# Altium schematic sheet DSP_Block.SchDoc
size A3; SheetNumber: 4; SheetTotal: 8
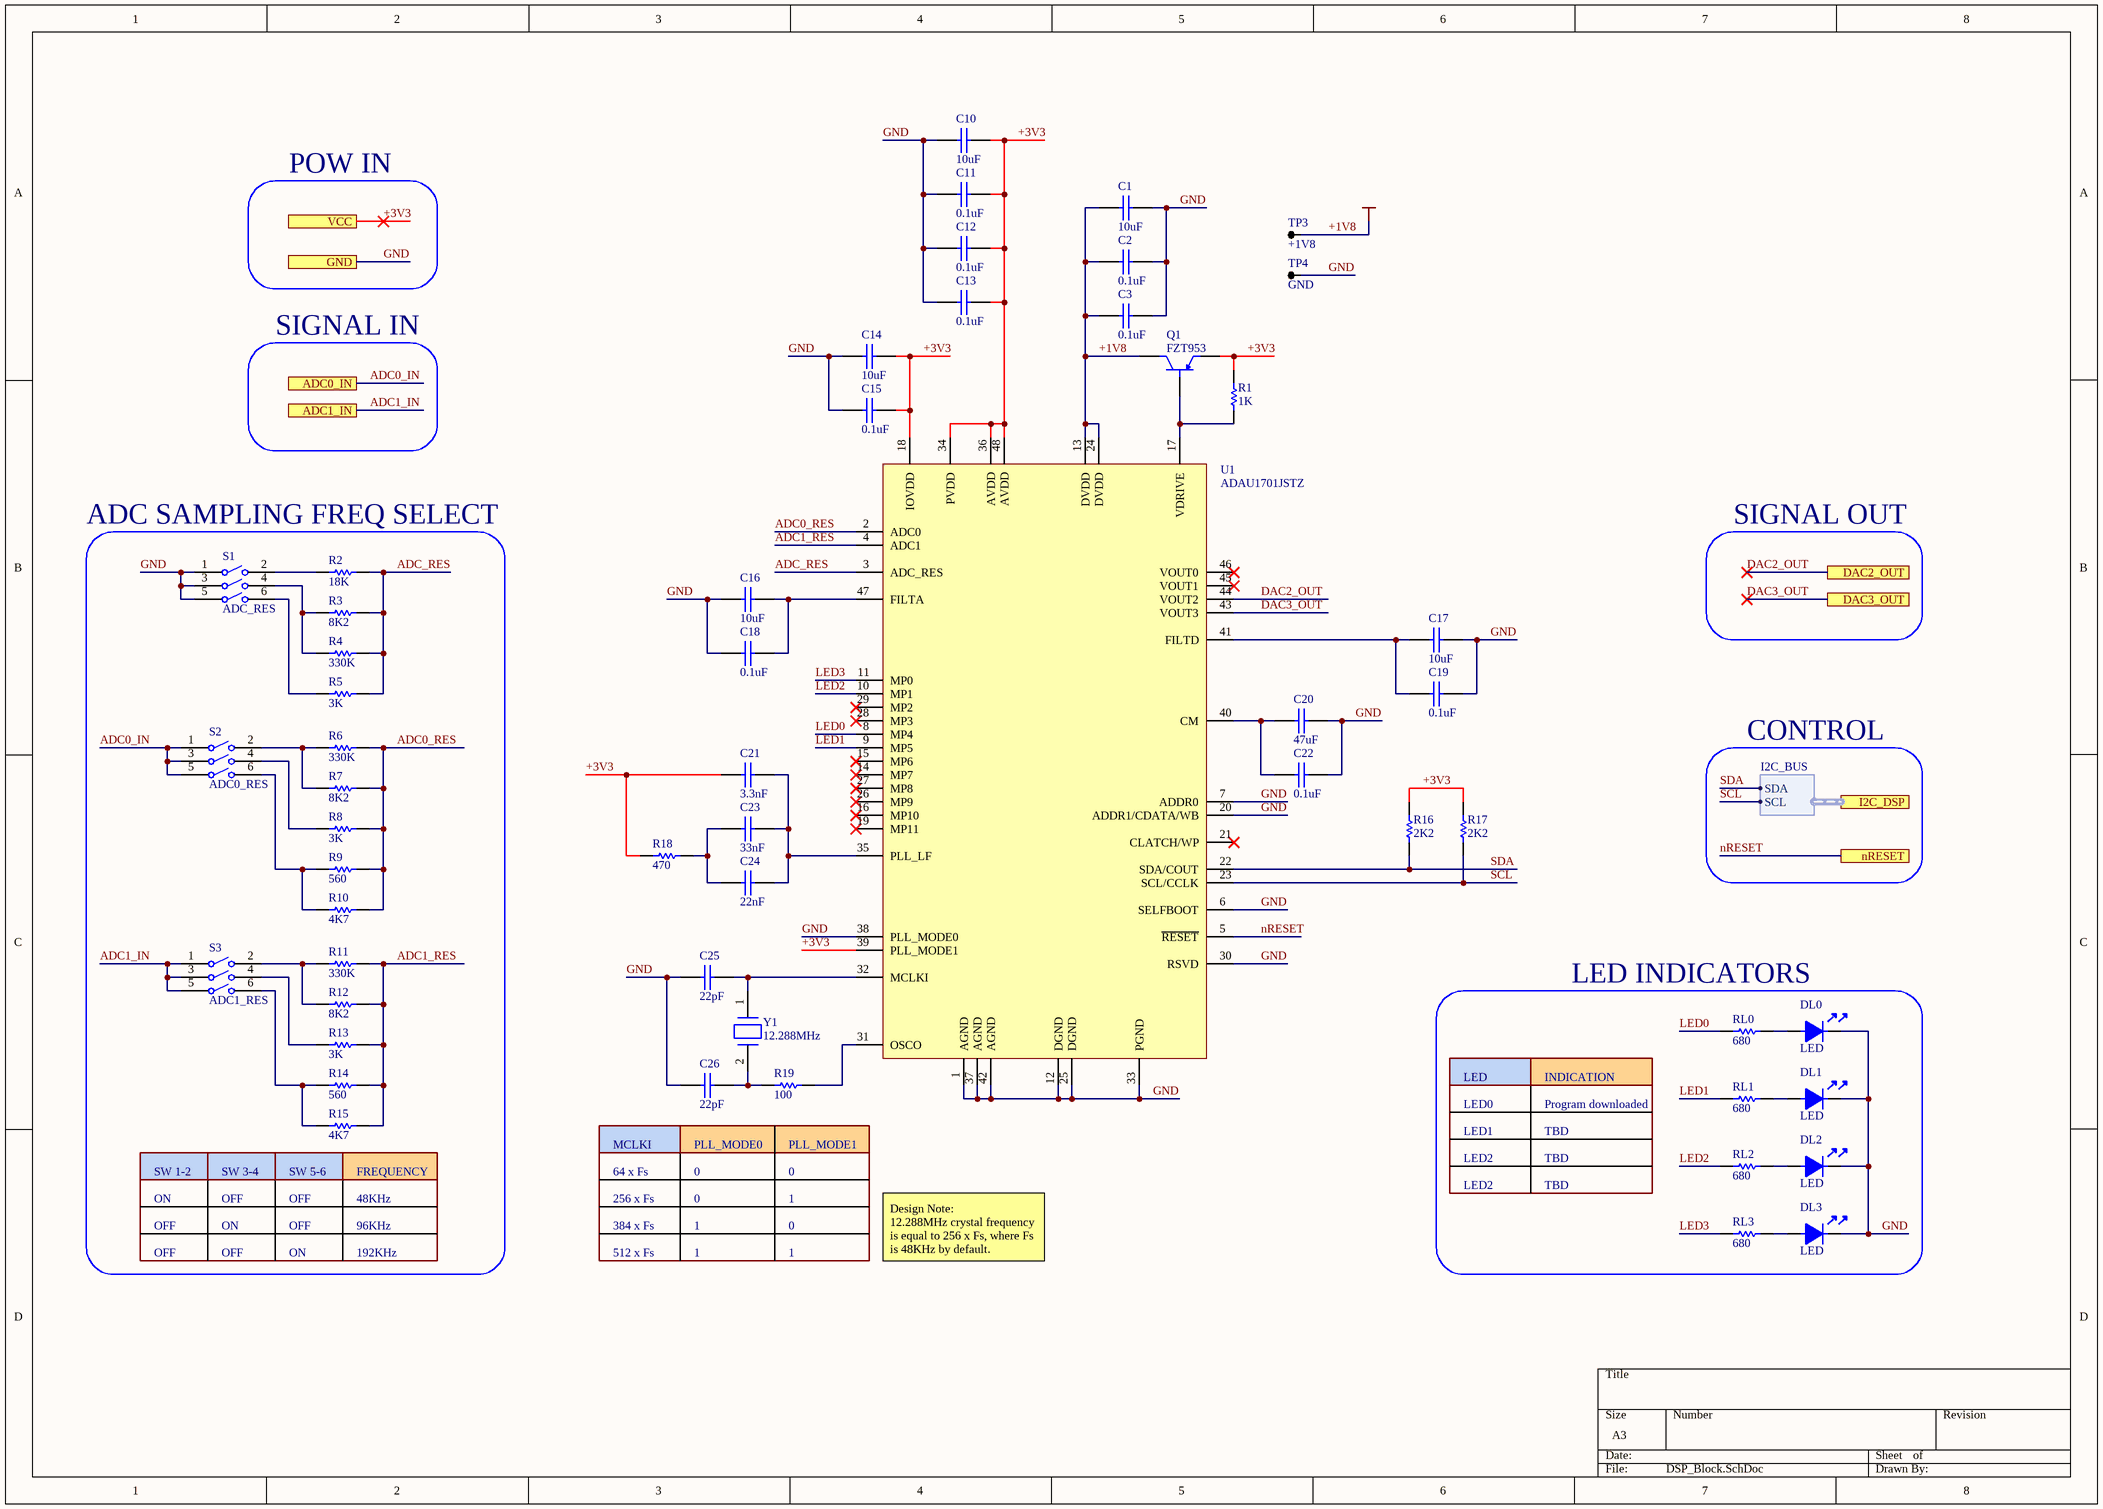
[diagram p0: DSP_Block.SchDoc]

## Parts
C1  10uF  [0805-CAP-TDK]
C2  0.1uF  [0402-CAP-TDK]
C3  0.1uF  [0402-CAP-TDK]
C10  10uF  [0805-CAP-TDK]
C11  0.1uF  [0402-CAP-TDK]
C12  0.1uF  [0402-CAP-TDK]
C13  0.1uF  [0402-CAP-TDK]
C14  10uF  [0805-CAP-TDK]
C15  0.1uF  [0402-CAP-TDK]
C16  10uF  [0805-CAP-TDK]
C17  10uF  [0805-CAP-TDK]
C18  0.1uF  [0402-CAP-TDK]
C19  0.1uF  [0402-CAP-TDK]
C20  47uF  [1206-CAP-TDK]
C21  3.3nF  [0402-CAP-TDK]
C22  0.1uF  [0402-CAP-TDK]
C23  33nF  [0603-CAP-TDK]
C24  22nF  [0603-CAP-TDK]
C25  22pF  [0402-CAP-TDK]
C26  22pF  [0402-CAP-TDK]
DL0  LED  [LED-3MM]
DL1  LED  [LED-3MM]
DL2  LED  [LED-3MM]
DL3  LED  [LED-3MM]
Q1  FZT953  [SOT223-DN]
R1  1K  [0402-RES-PANASONIC]
R2  18K  [0402-RES-PANASONIC]
R3  8K2  [0402-RES-PANASONIC]
R4  330K  [0402-RES-PANASONIC]
R5  3K  [0603-RES-PANASONIC]
R6  330K  [0402-RES-PANASONIC]
R7  8K2  [0402-RES-PANASONIC]
R8  3K  [0603-RES-PANASONIC]
R9  560  [0603-RES-PANASONIC]
R10  4K7  [0402-RES-PANASONIC]
R11  330K  [0402-RES-PANASONIC]
R12  8K2  [0402-RES-PANASONIC]
R13  3K  [0603-RES-PANASONIC]
R14  560  [0603-RES-PANASONIC]
R15  4K7  [0402-RES-PANASONIC]
R16  2K2  [0402-RES-PANASONIC]
R17  2K2  [0402-RES-PANASONIC]
R18  470  [0402-RES-PANASONIC]
R19  100  [0603-RES-PANASONIC]
RL0  680  [0402-RES-PANASONIC]
RL1  680  [0402-RES-PANASONIC]
RL2  680  [0402-RES-PANASONIC]
RL3  680  [0402-RES-PANASONIC]
S1  ADC_RES  [DIP-SW-3]
S2  ADC0_RES  [DIP-SW-3]
S3  ADC1_RES  [DIP-SW-3]
TP3  +1V8  [534-5280]
TP4  GND  [534-5280]
U1  ADAU1701JSTZ  [LQFP-48 - ST-48]
Y1  12.288MHz  [SMD5032]

## Blocks framed on the sheet
ADC SAMPLING FREQ SELECT: R2-R15 S1-S3
LED INDICATORS: DL0-DL3 RL0-RL3

## Ports
ADC0_IN, ADC1_IN, DAC2_OUT, DAC3_OUT, GND, I2C_DSP (harness I2C_BUS), nRESET, VCC

## Harnesses
I2C_BUS: SDA, SCL

## Nets
+1V8: C1.1 C2.1 C3.1 Q1.C TP3.1 U1.13(DVDD) U1.24(DVDD)
+3V3: C10.2 C11.2 C12.2 C13.2 C14.2 C15.2 C21.1 Q1.E R1.2 R16.2 R17.2 R18.2 U1.18(IOVDD) U1.34(PVDD) U1.36(AVDD) U1.39(PLL_MODE1) U1.48(AVDD) ; port VCC
ADC0_IN: S2.1 S2.3 S2.5 ; port ADC0_IN
ADC0_RES: R6.2 R7.2 R8.2 R9.2 R10.2 U1.2(ADC0)
ADC1_IN: S3.1 S3.3 S3.5 ; port ADC1_IN
ADC1_RES: R11.2 R12.2 R13.2 R14.2 R15.2 U1.4(ADC1)
ADC_RES: R2.2 R3.2 R4.2 R5.2 U1.3(ADC_RES)
DAC2_OUT: U1.44(VOUT2) ; port DAC2_OUT
DAC3_OUT: U1.43(VOUT3) ; port DAC3_OUT
GND: C1.2 C2.2 C3.2 C10.1 C11.1 C12.1 C13.1 C14.1 C15.1 C16.1 C17.2 C18.1 C19.2 C20.2 C22.2 C25.1 C26.1 DL0.2 DL1.2 DL2.2 DL3.2 S1.1 S1.3 S1.5 TP4.1 U1.1(AGND) U1.6(SELFBOOT) U1.7(ADDR0) U1.12(DGND) U1.20(ADDR1/CDATA/WB) U1.25(DGND) U1.30(RSVD) U1.33(PGND) U1.37(AGND) U1.38(PLL_MODE0) U1.42(AGND) ; port GND
LED0: RL0.2 U1.8(MP4)
LED1: RL1.2 U1.9(MP5)
LED2: RL2.2 U1.10(MP1)
LED3: RL3.2 U1.11(MP0)
nRESET: U1.5(~{RESET}) ; port nRESET
SCL: R17.1 U1.23(SCL/CCLK) ; port I2C_DSP.SCL
SDA: R16.1 U1.22(SDA/COUT) ; port I2C_DSP.SDA
NetC16_2: C16.2 C18.2 U1.47(FILTA)
NetC17_1: C17.1 C19.1 U1.41(FILTD)
NetC20_1: C20.1 C22.1 U1.40(CM)
NetC21_2: C21.2 C23.2 C24.2 U1.35(PLL_LF)
NetC23_1: C23.1 C24.1 R18.1
NetC25_2: C25.2 U1.32(MCLKI) Y1.1
NetC26_2: C26.2 R19.2 Y1.2
NetDL0_1: DL0.1 RL0.1
NetDL1_1: DL1.1 RL1.1
NetDL2_1: DL2.1 RL2.1
NetDL3_1: DL3.1 RL3.1
NetQ1_B: Q1.B R1.1 U1.17(VDRIVE)
NetR2_1: R2.1 S1.2
NetR3_1: R3.1 R4.1 S1.4
NetR5_1: R5.1 S1.6
NetR6_1: R6.1 R7.1 S2.2
NetR8_1: R8.1 S2.4
NetR9_1: R9.1 R10.1 S2.6
NetR11_1: R11.1 R12.1 S3.2
NetR13_1: R13.1 S3.4
NetR14_1: R14.1 R15.1 S3.6
NetR19_1: R19.1 U1.31(OSCO)

Not connected (* = marked no-connect by the designer): U1 14(MP7)* 15(MP6)* 16(MP10)* 19(MP11)* 21(CLATCH/WP)* 26(MP9)* 27(MP8)* 28(MP3)* 29(MP2)* 45(VOUT1)* 46(VOUT0)*

## Notes on the sheet
- POW IN
- SIGNAL IN
- SIGNAL OUT
- CONTROL
- LED0
- LED
- Program downloaded
- INDICATION
- SW 1-2
- SW 3-4
- (near R15) SW 5-6
- (near R15) FREQUENCY
- 64 x Fs
- MCLKI
- 0
- PLL_MODE0
- PLL_MODE1
- LED1
- LED2
- TBD
- ON
- OFF
- 48KHz
- 96KHz
- 192KHz
- 256 x Fs
- 384 x Fs
- 512 x Fs
- 1
- Design Note:
  12.288MHz crystal frequency is equal to 256 x Fs, where Fs is 48KHz by default.

## Library data of the parts
C1-C3 C10-C26 = CAP-SMD
  C1 C10 C14 C16 C17: JLCPart: C15850
  C2 C3 C11-C13 C15 C18 C19 C22: JLCPart: C307331
  C20: JLCPart: C96123
  C21: JLCPart: C26404
  C23: JLCPart: C21117
  C24: JLCPart: C21122
  C25 C26: JLCPart: C1555
R1-R19 RL0-RL3 = RES-SMD
  R1: JLCPart: C11702
  R2: JLCPart: C25762
  R3 R7 R12: JLCPart: C25924
  R4 R6 R11: JLCPart: C25778
  R5 R8 R13: JLCPart: C4211
  R9 R14: JLCPart: C23204
  R10 R15: JLCPart: C25900
  R16 R17: JLCPart: C25879
  R18: JLCPart: C25117
  R19: JLCPart: C22775
  RL0-RL3: JLCPart: C25130
S1-S3 = DIP-SW-3
TP3 TP4 = TP-CLAW
U1 = ADAU1701JSTZ: SigmaDSP 28-/56-Bit Audio Processor with Two ADCs and Four DACs; JLCPart: C389590
Y1 = 12.288MHz Crystal: JLCPart: C251589
Q1 = FZT953: JLCPart: C499616